# Altium schematic sheet PowerMeter.SchDoc
size A3 portrait
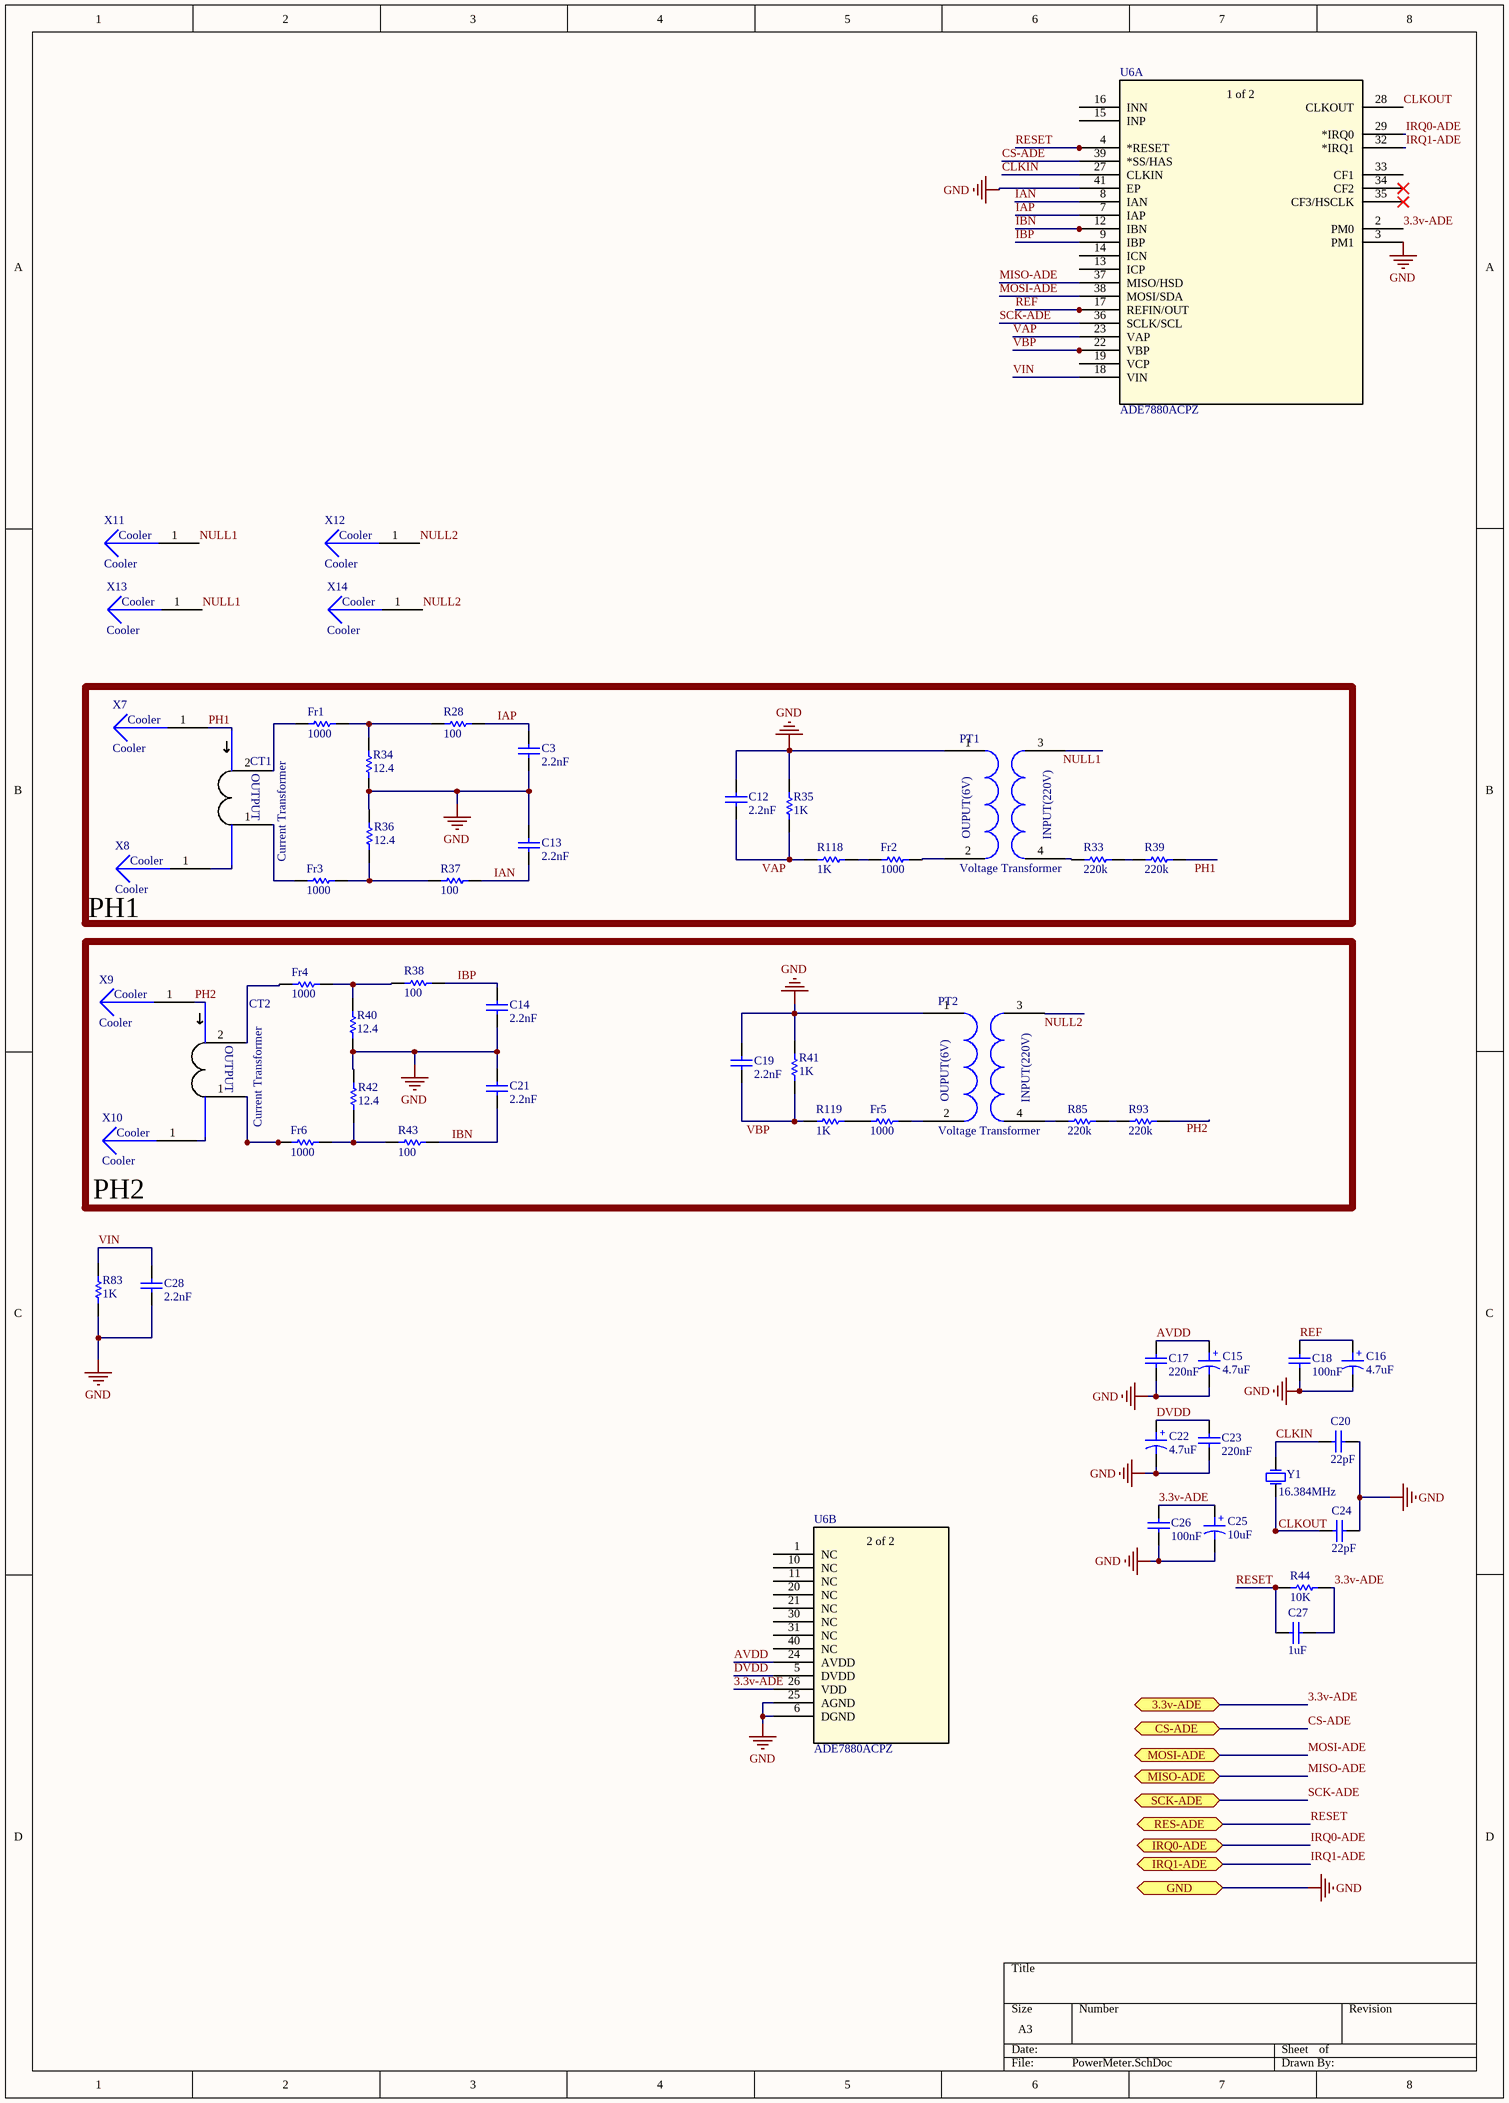
[diagram p0: PowerMeter.SchDoc]

## Parts
C3  2.2nF  [CAPC3413X12N]
C12  2.2nF  [CAPC3413X12N]
C13  2.2nF  [CAPC3413X12N]
C14  2.2nF  [CAPC3413X12N]
C15  4.7uF  [CAPP 1206 (3216X18L) Size A]
C16  4.7uF  [CAPP 1206 (3216X18L) Size A]
C17  220nF  [CAPC3413X12N]
C18  100nF  [CAPC3413X12N]
C19  2.2nF  [CAPC3413X12N]
C20  22pF  [CAPC3413X12N]
C21  2.2nF  [CAPC3413X12N]
C22  4.7uF  [CAPP 1206 (3216X18L) Size A]
C23  220nF  [CAPC3413X12N]
C24  22pF  [CAPC3413X12N]
C25  10uF  [CAPP 1206 (3216X18L) Size A]
C26  100nF  [CAPC3413X12N]
C27  1uF  [CAPC3413X12N]
C28  2.2nF  [CAPC3413X12N]
CT1  Current Transformer  [Current Transformer_60/0.06]
CT2  Current Transformer  [Current Transformer_60/0.06]
Fr1  1000  [RESC3413X04N]
Fr2  1000  [RESC3413X04N]
Fr3  1000  [RESC3413X04N]
Fr4  1000  [RESC3413X04N]
Fr5  1000  [RESC3413X04N]
Fr6  1000  [RESC3413X04N]
PT1  Voltage Transformer  [Isolated Voltage Transformer]
PT2  Voltage Transformer  [Isolated Voltage Transformer]
R28  100  [RESC3413X04N]
R33  value 220k  [RES2512]  (hidden comment: Resistor)
R34  12.4  [RESC3413X04N]
R35  1K  [RESC3413X04N]
R36  12.4  [RESC3413X04N]
R37  100  [RESC3413X04N]
R38  100  [RESC3413X04N]
R39  value 220k  [RES2512]  (hidden comment: Resistor)
R40  12.4  [RESC3413X04N]
R41  1K  [RESC3413X04N]
R42  12.4  [RESC3413X04N]
R43  100  [RESC3413X04N]
R44  10K  [RESC3413X04N]
R83  1K  [RESC3413X04N]
R85  value 220k  [RES2512]  (hidden comment: Resistor)
R93  value 220k  [RES2512]  (hidden comment: Resistor)
R118  1K  [RESC3413X04N]
R119  1K  [RESC3413X04N]
U6  ADE7880ACPZ  [CP_40_10_ADI]  (parts A,B of 2)
X7  Cooler  [Cooler]
X8  Cooler  [Cooler]
X9  Cooler  [Cooler]
X10  Cooler  [Cooler]
X11  Cooler  [Cooler]
X12  Cooler  [Cooler]
X13  Cooler  [Cooler]
X14  Cooler  [Cooler]
Y1  16.384MHz  [Crystal SMD]

## Blocks framed on the sheet
PH1: C3 C12 C13 CT1 Fr1-Fr3 PT1 R28 R33-R37 R39 R118 X7 X8
PH2: C14 C19 C21 CT2 Fr4-Fr6 PT2 R38 R40-R43 R85 R93 R119 X9 X10

## Ports
3.3v-ADE (bidir), CS-ADE (bidir), GND (bidir), IRQ0-ADE (bidir), IRQ1-ADE (bidir), MISO-ADE (bidir), MOSI-ADE (bidir), RES-ADE (bidir), SCK-ADE (bidir)

## Nets
GND: C3.1 C12.1 C13.1 C14.1 C15.2 C16.2 C17.1 C18.1 C19.1 C20.1 C21.1 C22.2 C23.1 C24.1 C25.2 C26.1 C28.1 PT1.1(OUT_1) PT2.1(OUT_1) R34.2 R35.1 R36.1 R40.2 R41.1 R42.1 R83.1 U6.3(PM1) U6.6(DGND) U6.25(AGND) U6.41(EP) ; port GND
3.3v-ADE: C25.1 C26.2 C27.1 R44.2 U6.2(PM0) U6.26(VDD) ; port 3.3v-ADE
AVDD: C15.1 C17.2 U6.24(AVDD)
CLKIN: C20.2 U6.27(CLKIN) Y1.2(OSC2)
CLKOUT: C24.2 U6.28(CLKOUT) Y1.1(OSC1)
CS-ADE: U6.39(*SS/HAS) ; port CS-ADE
DVDD: C22.1 C23.2 U6.5(DVDD)
IAN: C13.2 R37.2 U6.8(IAN)
IAP: C3.2 R28.2 U6.7(IAP)
IBN: C21.2 R43.2 U6.12(IBN)
IBP: C14.2 R38.2 U6.9(IBP)
IRQ0-ADE: U6.29(*IRQ0) ; port IRQ0-ADE
IRQ1-ADE: U6.32(*IRQ1) ; port IRQ1-ADE
MISO-ADE: U6.37(MISO/HSD) ; port MISO-ADE
MOSI-ADE: U6.38(MOSI/SDA) ; port MOSI-ADE
NULL1: PT1.3(IN_1) X11.1 X13.1
NULL2: PT2.3(IN_1) X12.1 X14.1
PH1: CT1.4 R39.2 X7.1
PH2: CT2.4 R93.2 X9.1
REF: C16.1 C18.2 U6.17(REFIN/OUT)
RESET: C27.2 R44.1 U6.4(*RESET) ; port RES-ADE
SCK-ADE: U6.36(SCLK/SCL) ; port SCK-ADE
VAP: C12.2 R35.2 R118.1 U6.23(VAP)
VBP: C19.2 R41.2 R119.1 U6.22(VBP)
VIN: C28.2 R83.2 U6.18(VIN)
NetCT1_1: CT1.1(IN) Fr3.1
NetCT1_2: CT1.2(OUT) Fr1.1
NetCT1_3: CT1.3 X8.1
NetCT2_1: CT2.1(IN) Fr6.1
NetCT2_2: CT2.2(OUT) Fr4.1
NetCT2_3: CT2.3 X10.1
NetFr1_2: Fr1.2 R28.1 R34.1
NetFr2_1: Fr2.1 PT1.2(OUT_2)
NetFr2_2: Fr2.2 R118.2
NetFr3_2: Fr3.2 R36.2 R37.1
NetFr4_2: Fr4.2 R38.1 R40.1
NetFr5_1: Fr5.1 PT2.2(OUT_2)
NetFr5_2: Fr5.2 R119.2
NetFr6_2: Fr6.2 R42.2 R43.1
NetPT1_4: PT1.4(IN_2) R33.2
NetPT2_4: PT2.4(IN_2) R85.2
NetR33_1: R33.1 R39.1
NetR85_1: R85.1 R93.1

Not connected (* = marked no-connect by the designer): U6 1(NC) 10(NC) 11(NC) 13(ICP) 14(ICN) 15(INP) 16(INN) 19(VCP) 20(NC) 21(NC) 30(NC) 31(NC) 33(CF1) 34(CF2)* 35(CF3/HSCLK)* 40(NC)

## Notes on the sheet
- (in symbol ADE7880ACPZ, part A) 1 of 2
- (in symbol ADE7880ACPZ, part B) 2 of 2
- (in symbol Cap ELECTROLITIC TOTAL SIZE) +
- (in symbol Current Transformer) OUTPUT
- (in symbol Voltage Transformer) INPUT(220V); OUPUT(6V)

## Library data of the parts
C3 C12-C14 C17-C21 C23 C24 C26-C28 = CAP SMD 0805: CAP 0805; Designer: Abbas Basereh; Desc.: CAP SMD 0805; Data: 16-12-2016
C15 C16 C22 C25 = Cap ELECTROLITIC TOTAL SIZE: Cap electrolitic radial; Designer: Abbas Basereh; VALUE: 1uF; Data: 16-12-2016; Part. No: *
Fr1-Fr6 R28 R34-R38 R40-R44 R83 R118 R119 = RES 0805 0.125W: RES 0805; Designer: Abbas Basereh; Desc.: RES SMD 0805; Data: 16-12-2016
U6 = ADE7880ACPZ: No Description Available; Mfr_Name: Analog Devices Inc; Copyright: Copyright (C) 2022 Ultra Librarian. All rights reserved.; Manufacturer_Part_Number: ADE7880ACPZ; RefDes: RefDes; Type: DEV
Y1 = XTAL: XTAL Crystal; Designer: ABBAS BASEREH; Value: 12 MHz; Design Date: 2017-1-3; ComponentLink1Description: Datasheet; ComponentLink2Description: Reference; Mounting Technology: Surface Mount\Through-Hole; Status: Unreleased